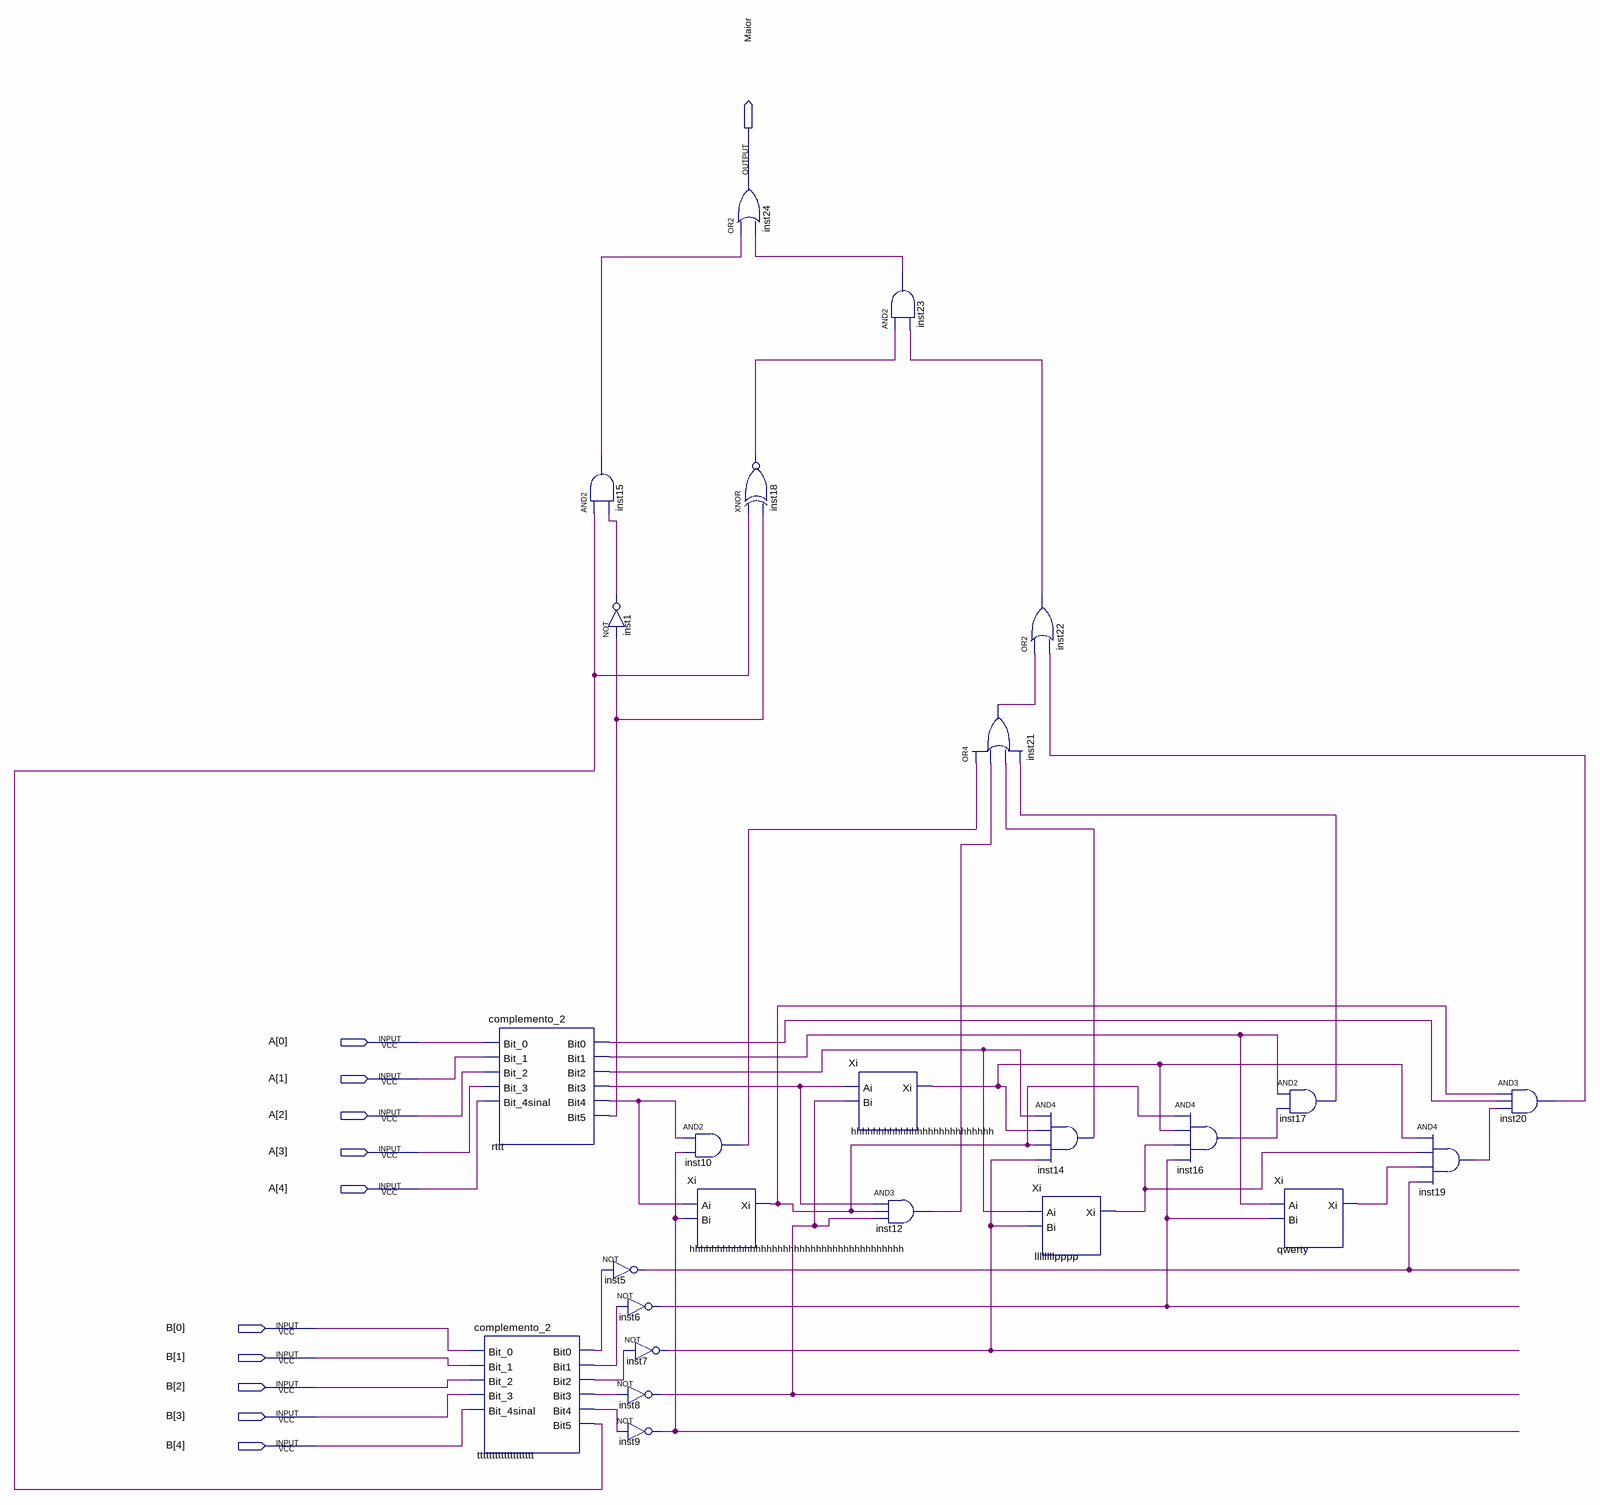
[diagram p0: schematic sheet]
// Quartus schematic comparador_maior.bdf as structural Verilog: 25 symbols, 11 pins
module comparador_maior (
  input  [4:0] A,
  input  [4:0] B,
  output Maior
);

  wire hhhhhhhhhhhhhhhhhhhhhhhhhh_xi, hhhhhhhhhhhhhhhhhhhhhhhhhhhhhhhhhhhhhhh_xi, inst1_out, inst5_out,
       inst6_out, inst7_out, inst8_out, inst9_out, inst10_out, inst12_out, inst14_out, inst15_out,
       inst16_out, inst17_out, inst18_out, inst19_out, inst20_out, inst21_out, inst22_out, inst23_out,
       llllllllpppp_xi, qwerty_xi, rttt_bit0, rttt_bit1, rttt_bit2, rttt_bit3, rttt_bit4, rttt_bit5,
       ttttttttttttttttttt_bit0, ttttttttttttttttttt_bit1, ttttttttttttttttttt_bit2,
       ttttttttttttttttttt_bit3, ttttttttttttttttttt_bit4, ttttttttttttttttttt_bit5;

  complemento_2 ttttttttttttttttttt (
    .Bit_0(B[0]), .Bit_1(B[1]), .Bit_2(B[2]), .Bit_3(B[3]), .Bit_4sinal(B[4]),
    .Bit0(ttttttttttttttttttt_bit0), .Bit1(ttttttttttttttttttt_bit1), .Bit2(ttttttttttttttttttt_bit2),
    .Bit3(ttttttttttttttttttt_bit3), .Bit4(ttttttttttttttttttt_bit4), .Bit5(ttttttttttttttttttt_bit5));
  complemento_2 rttt (
    .Bit_0(A[0]), .Bit_1(A[1]), .Bit_2(A[2]), .Bit_3(A[3]), .Bit_4sinal(A[4]), .Bit0(rttt_bit0),
    .Bit1(rttt_bit1), .Bit2(rttt_bit2), .Bit3(rttt_bit3), .Bit4(rttt_bit4), .Bit5(rttt_bit5));
  and inst15 (inst15_out, ttttttttttttttttttt_bit5, inst1_out);
  not inst1 (inst1_out, rttt_bit5);
  not inst5 (inst5_out, ttttttttttttttttttt_bit0);
  not inst6 (inst6_out, ttttttttttttttttttt_bit1);
  not inst7 (inst7_out, ttttttttttttttttttt_bit2);
  not inst8 (inst8_out, ttttttttttttttttttt_bit3);
  not inst9 (inst9_out, ttttttttttttttttttt_bit4);
  and inst10 (inst10_out, rttt_bit4, inst9_out);
  Xi hhhhhhhhhhhhhhhhhhhhhhhhhhhhhhhhhhhhhhh (
    .Ai(rttt_bit4), .Bi(inst9_out), .Xi(hhhhhhhhhhhhhhhhhhhhhhhhhhhhhhhhhhhhhhh_xi));
  or inst24 (Maior, inst15_out, inst23_out);
  xnor inst18 (inst18_out, ttttttttttttttttttt_bit5, rttt_bit5);
  and inst23 (inst23_out, inst18_out, inst22_out);
  Xi hhhhhhhhhhhhhhhhhhhhhhhhhh (.Ai(rttt_bit3), .Bi(inst8_out), .Xi(hhhhhhhhhhhhhhhhhhhhhhhhhh_xi));
  and inst12 (inst12_out, rttt_bit3, hhhhhhhhhhhhhhhhhhhhhhhhhhhhhhhhhhhhhhh_xi, inst8_out);
  or inst21 (inst21_out, inst10_out, inst12_out, inst14_out, inst17_out);
  or inst22 (inst22_out, inst21_out, inst20_out);
  and inst14 (inst14_out, rttt_bit2, hhhhhhhhhhhhhhhhhhhhhhhhhh_xi, hhhhhhhhhhhhhhhhhhhhhhhhhhhhhhhhhhhhhhh_xi, inst7_out);
  Xi llllllllpppp (.Ai(rttt_bit2), .Bi(inst7_out), .Xi(llllllllpppp_xi));
  and inst16 (inst16_out, hhhhhhhhhhhhhhhhhhhhhhhhhhhhhhhhhhhhhhh_xi, hhhhhhhhhhhhhhhhhhhhhhhhhh_xi, llllllllpppp_xi, inst6_out);
  and inst17 (inst17_out, rttt_bit1, inst16_out);
  Xi qwerty (.Ai(rttt_bit1), .Bi(inst6_out), .Xi(qwerty_xi));
  and inst19 (inst19_out, hhhhhhhhhhhhhhhhhhhhhhhhhh_xi, llllllllpppp_xi, qwerty_xi, inst5_out);
  and inst20 (inst20_out, hhhhhhhhhhhhhhhhhhhhhhhhhhhhhhhhhhhhhhh_xi, rttt_bit0, inst19_out);
endmodule
